# Altium schematic sheet top.SchDoc
size A4
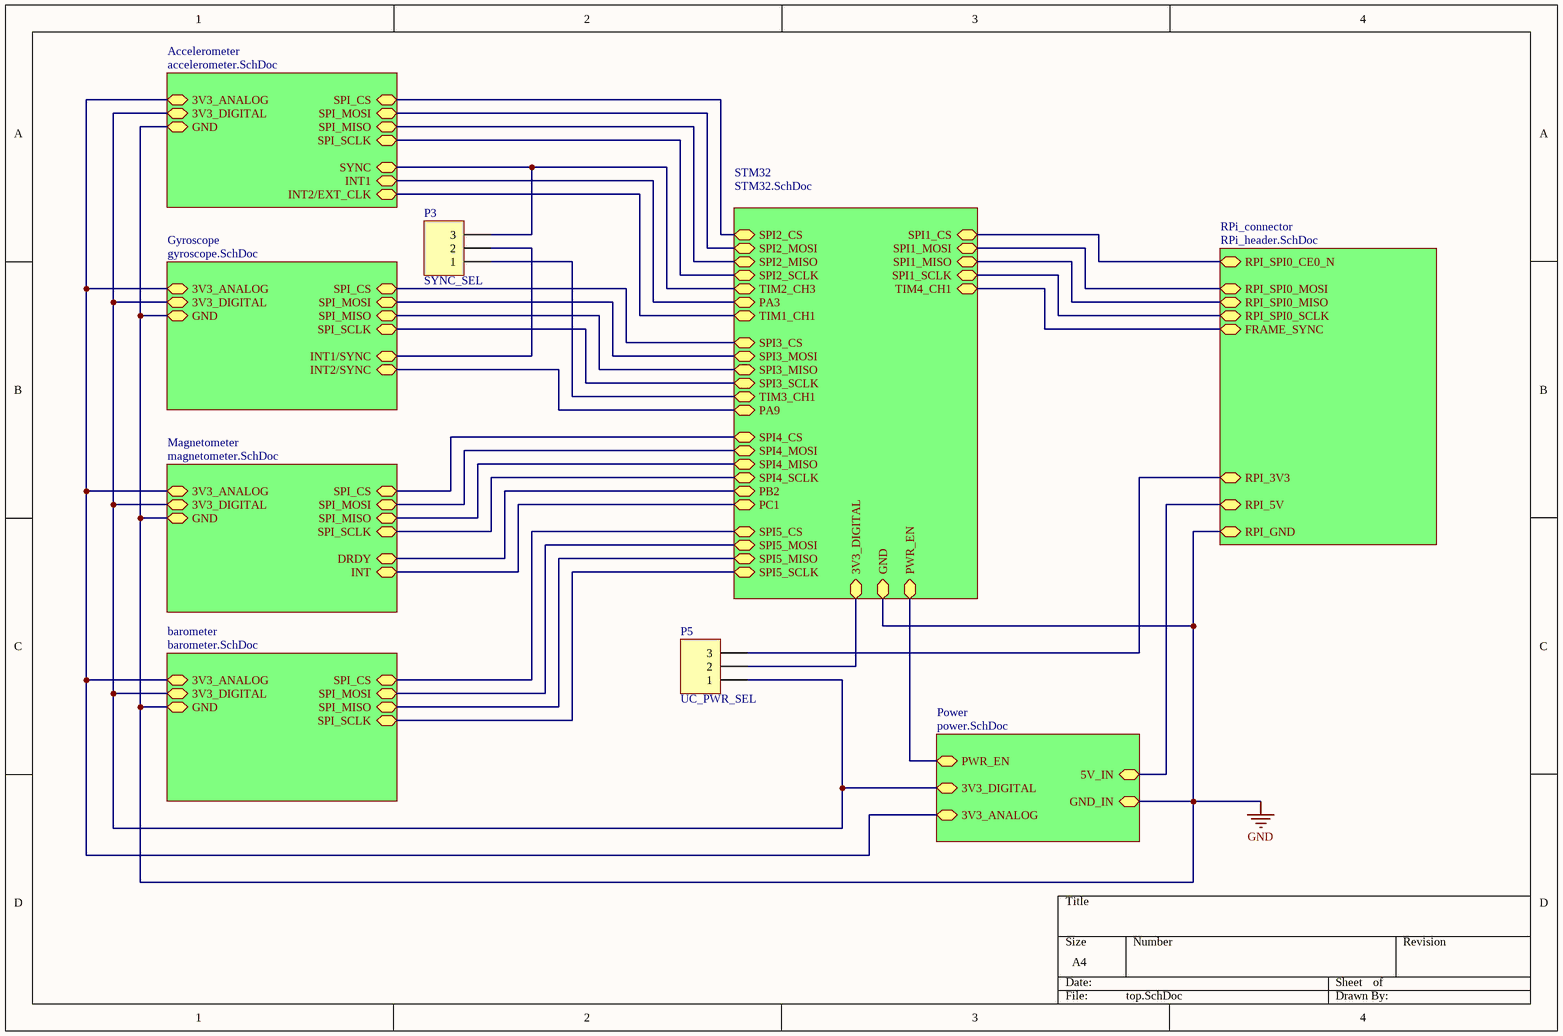
[diagram p0: top.SchDoc]

## Parts
P3  SYNC_SEL  [HDR1X3]
P5  UC_PWR_SEL  [HDR1X3]

## Sub-sheets
Accelerometer = accelerometer.SchDoc: 3V3_ANALOG, 3V3_DIGITAL, GND, INT1, INT2/EXT_CLK, SYNC, SPI_CS, SPI_MOSI, SPI_SCLK, SPI_MISO
barometer = barometer.SchDoc: 3V3_DIGITAL, 3V3_ANALOG, GND, SPI_MISO, SPI_CS, SPI_MOSI, SPI_SCLK
Gyroscope = gyroscope.SchDoc: GND, 3V3_ANALOG, 3V3_DIGITAL, INT2/SYNC, SPI_MOSI, SPI_MISO, SPI_SCLK, INT1/SYNC, SPI_CS
Magnetometer = magnetometer.SchDoc: 3V3_ANALOG, GND, SPI_SCLK, SPI_MOSI, SPI_CS, DRDY, INT, SPI_MISO, 3V3_DIGITAL
Power = power.SchDoc: 3V3_DIGITAL, 3V3_ANALOG, 5V_IN, GND_IN, PWR_EN
RPi_connector = RPi_header.SchDoc: RPI_SPI0_MOSI, RPI_SPI0_MISO, FRAME_SYNC, RPI_SPI0_SCLK, RPI_SPI0_CE0_N, RPI_5V, RPI_GND, RPI_3V3
STM32 = STM32.SchDoc: 3V3_DIGITAL, GND, TIM4_CH1, SPI4_MOSI, SPI5_SCLK, SPI5_CS, SPI4_CS, SPI4_SCLK, SPI5_MOSI, SPI1_MISO, SPI1_MOSI, SPI2_MISO, SPI2_MOSI, SPI2_SCLK, SPI3_MISO, SPI3_MOSI, SPI1_SCLK, SPI1_CS, SPI2_CS, SPI3_SCLK, SPI3_CS, TIM1_CH1, TIM2_CH3, TIM3_CH1, SPI4_MISO, SPI5_MISO, PA3, PA9, PB2, PC1, PWR_EN

## Nets
GND: sheet RPi_connector/RPI_GND, sheet STM32/GND, sheet Accelerometer/GND, sheet Power/GND_IN, sheet Gyroscope/GND, sheet Magnetometer/GND, sheet barometer/GND
NetP3_1: P3.1 ; sheet STM32/TIM3_CH1
NetP3_2: P3.2 ; sheet Gyroscope/INT1/SYNC
NetP3_3: P3.3 ; sheet STM32/TIM2_CH3, sheet Accelerometer/SYNC
NetP5_1: P5.1 ; sheet Accelerometer/3V3_DIGITAL, sheet Power/3V3_DIGITAL, sheet Gyroscope/3V3_DIGITAL, sheet Magnetometer/3V3_DIGITAL, sheet barometer/3V3_DIGITAL
NetP5_2: P5.2 ; sheet STM32/3V3_DIGITAL
NetP5_3: P5.3 ; sheet RPi_connector/RPI_3V3
(unnamed): sheet RPi_connector/RPI_SPI0_MOSI, sheet STM32/SPI1_MOSI
(unnamed): sheet RPi_connector/RPI_SPI0_MISO, sheet STM32/SPI1_MISO
(unnamed): sheet RPi_connector/FRAME_SYNC, sheet STM32/TIM4_CH1
(unnamed): sheet RPi_connector/RPI_SPI0_SCLK, sheet STM32/SPI1_SCLK
(unnamed): sheet RPi_connector/RPI_SPI0_CE0_N, sheet STM32/SPI1_CS
(unnamed): sheet RPi_connector/RPI_5V, sheet Power/5V_IN
(unnamed): sheet STM32/SPI4_MOSI, sheet Magnetometer/SPI_MOSI
(unnamed): sheet STM32/SPI5_SCLK, sheet barometer/SPI_SCLK
(unnamed): sheet STM32/SPI5_CS, sheet barometer/SPI_CS
(unnamed): sheet STM32/SPI4_CS, sheet Magnetometer/SPI_CS
(unnamed): sheet STM32/SPI4_SCLK, sheet Magnetometer/SPI_SCLK
(unnamed): sheet STM32/SPI5_MOSI, sheet barometer/SPI_MOSI
(unnamed): sheet STM32/SPI2_MISO, sheet Accelerometer/SPI_MISO
(unnamed): sheet STM32/SPI2_MOSI, sheet Accelerometer/SPI_MOSI
(unnamed): sheet STM32/SPI2_SCLK, sheet Accelerometer/SPI_SCLK
(unnamed): sheet STM32/SPI3_MISO, sheet Gyroscope/SPI_MISO
(unnamed): sheet STM32/SPI3_MOSI, sheet Gyroscope/SPI_MOSI
(unnamed): sheet STM32/SPI2_CS, sheet Accelerometer/SPI_CS
(unnamed): sheet STM32/SPI3_SCLK, sheet Gyroscope/SPI_SCLK
(unnamed): sheet STM32/SPI3_CS, sheet Gyroscope/SPI_CS
(unnamed): sheet STM32/TIM1_CH1, sheet Accelerometer/INT2/EXT_CLK
(unnamed): sheet STM32/SPI4_MISO, sheet Magnetometer/SPI_MISO
(unnamed): sheet STM32/SPI5_MISO, sheet barometer/SPI_MISO
(unnamed): sheet STM32/PA3, sheet Accelerometer/INT1
(unnamed): sheet STM32/PA9, sheet Gyroscope/INT2/SYNC
(unnamed): sheet STM32/PB2, sheet Magnetometer/DRDY
(unnamed): sheet STM32/PC1, sheet Magnetometer/INT
(unnamed): sheet STM32/PWR_EN, sheet Power/PWR_EN
(unnamed): sheet Accelerometer/3V3_ANALOG, sheet Power/3V3_ANALOG, sheet Gyroscope/3V3_ANALOG, sheet Magnetometer/3V3_ANALOG, sheet barometer/3V3_ANALOG

## Library data of the parts
P3 P5 = Header 3: Header, 3-Pin; LatestRevisionDate: 17-Jul-2002; LatestRevisionNote: Re-released for DXP Platform.; Publisher: Altium Limited